# EAGLE design AT26 Chuck (EAGLE 7.2.0)
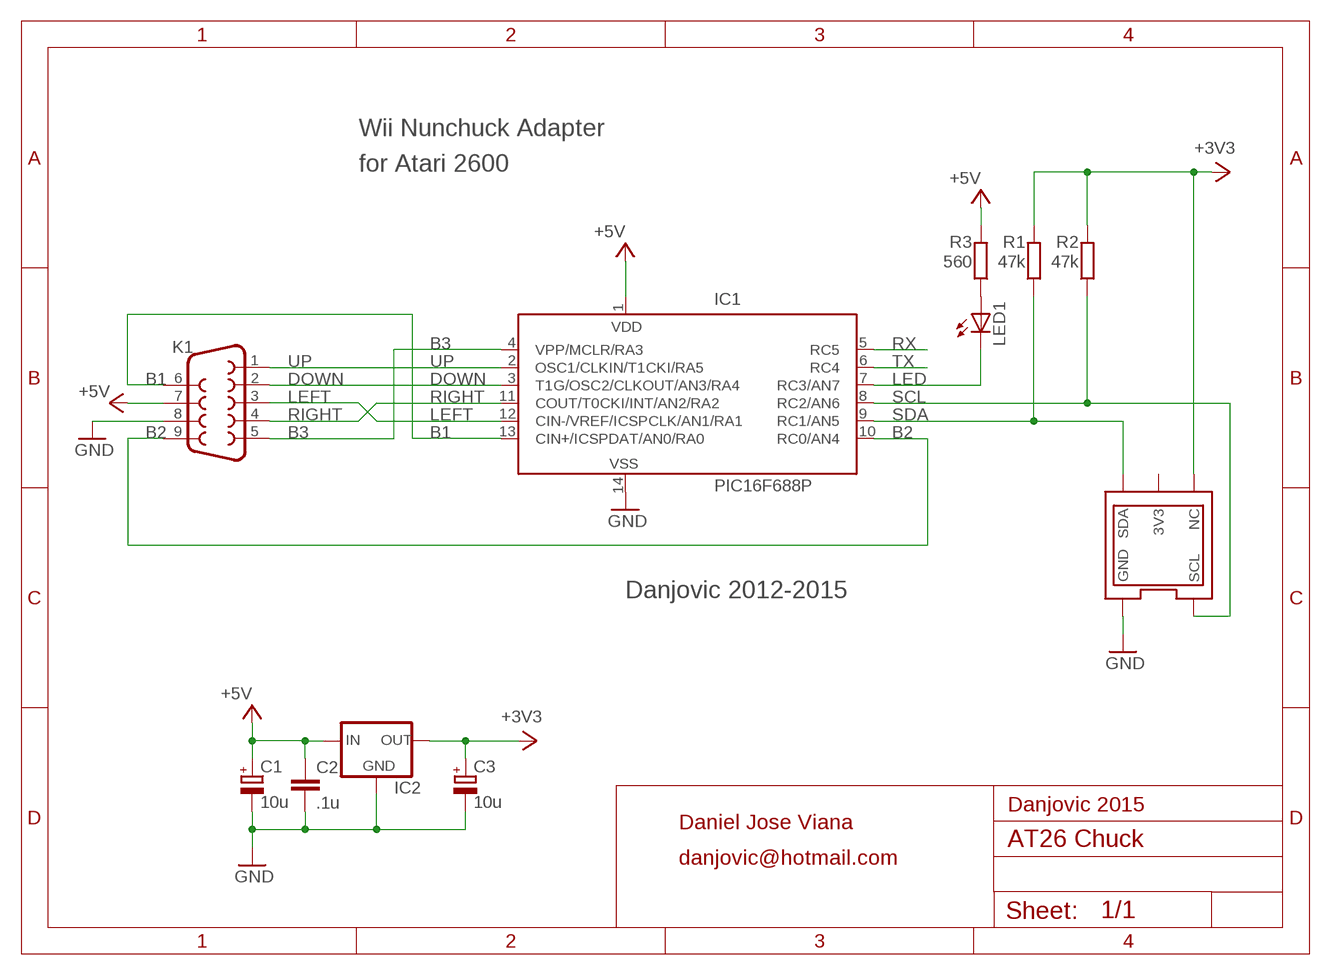
[diagram p0: schematic, sheet 1]

## Parts
C1  10u  CPOL-EUE2.5-5  [E2,5-5]
C2  .1u  C-EU  [C025-024X044L]
C3  10u  CPOL-EUE2.5-5  [E2,5-5]
IC1  PIC16F688P  PIC16F676P  [DIL14]
IC2  78LXX78LXX_L  [78LXX_L]
K1  F09D  [F09D]
LED1  LED3MM  [LED3MM]
R1  47k  R-EU_0204/2V  [0204V]
R2  47k  R-EU_0204/2V  [0204V]
R3  560  R-EU_0204/2V  [0204V]
U$1  NUNCHUCK  NUNCHUCKSLOT  [NUNCHUCK_SLOT]

## Nets
+3V3: C3.+ IC2.OUT R1.2 R2.2 U$1.NC
+5V: C1.+ C2.1 IC1.1(VDD) IC2.IN K1.7 R3.2
B1: IC1.13(CIN+/ICSPDAT/AN0/RA0) K1.6
B2: IC1.10(RC0/AN4) K1.9
B3: IC1.4(VPP/MCLR/RA3) K1.5
DOWN: IC1.3(T1G/OSC2/CLKOUT/AN3/RA4) K1.2
GND: C1.- C2.2 C3.- IC1.14(VSS) IC2.GND K1.8 U$1.GND
LED: IC1.7(RC3/AN7) LED1.K(C)
LEFT: IC1.12(CIN-/VREF/ICSPCLK/AN1/RA1) K1.3
N$4: LED1.A R3.1
RIGHT: IC1.11(COUT/T0CKI/INT/AN2/RA2) K1.4
RX: IC1.5(RC5)
SCL: IC1.8(RC2/AN6) R2.1 U$1.SCL
SDA: IC1.9(RC1/AN5) R1.1 U$1.SDA
TX: IC1.6(RC4)
UP: IC1.2(OSC1/CLKIN/T1CKI/RA5) K1.1
Unconnected: U$1.3V3

## Notes on the sheet
- Wii Nunchuck Adapter
- for Atari 2600
- Danjovic 2012-2015
- Danjovic 2015
- Daniel Jose Viana
- danjovic@hotmail.com

## Library data of the parts
C1 C3 = rcl:CPOL-EU: POLARIZED CAPACITOR, European symbol
C2 = rcl:C-EU: CAPACITOR, European symbol
IC1 = microchip:PIC16F676: 14-Pin, Flash-Based 8-Bit CMOS Microcontroller High Performance RISC CPU: * Only 35 instructions to learn - All single-cycle instructions except branches * Operating speed: - DC - 20 MHz oscillator/clock input - DC - 200 ns instruction cycle * Internal and external oscillator options - Precision Internal 4 MHz oscillator factory calibrated to ±1% - External Oscillator support for crystals and resonators - 5?s wake-up from SLEEP, 3.0V, typical * Power saving SLEEP mode * Wide operating voltage range - 2.0V to 5.5V * Industrial and Extended temperature range * Low power Power-on Reset (POR) * Power-up Timer (PWRT) and Oscillator Start-up Timer (OST) * Brown-out Detect (BOD) * Watchdog Timer (WDT) with independent oscillator for reliable operation * Multiplexed MCLR/Input-pin * Interrupt-on-pin change * Individual programmable weak pull-ups * Programmable code protection * High Endurance FLASH/EEPROM Cell - 100,000 write FLASH endurance - 1,000,000 write EEPROM endurance - FLASH/Data EEPROM Retention: > 40 years * Standby Current: - 1 nA @ 2.0V, typical * Operating Current: - 8.5?A @ 32 kHz, 2.0V, typical - 100?A @ 1 MHz, 2.0V, typical * Watchdog Timer Current - 300 nA @ 2.0V, typical * Timer1 oscillator current: - 4?A @ 32 kHz, 2.0V, typical * 12 I/O pins with individual direction control * High current sink/source for direct LED drive * Analog-to-Digital Converter module (PIC16F676): - 10-bit resolution - Programmable 8-channel input - Voltage reference input * In-Circuit Serial ProgrammingTM (ICSPTM) via two pins Source: http://ww1.microchip.com/downloads/en/DeviceDoc/40039E.pdf; MF: MICROCHIP; MPN: PIC16F676-I/P; OC_FARNELL: 9760512; OC_NEWARK: 54K2829
IC2 = v-reg:78LXX: VOLTAGE REGULATOR
K1 = con-subd:F09: SUB-D; OC_FARNELL: unknown; OC_NEWARK: unknown
LED1 = led:LED: LED OSRAM: - CHIPLED LG R971, LG N971, LY N971, LG Q971, LY Q971, LO R971, LY R971 LH N974, LH R974 LS Q976, LO Q976, LY Q976 LO Q996 - Hyper CHIPLED LW Q18S LB Q993, LB Q99A, LB R99A - SideLED LS A670, LO A670, LY A670, LG A670, LP A670 LB A673, LV A673, LT A673, LW A673 LH A674 LY A675 LS A676, LA A676, LO A676, LY A676, LW A676 LS A679, LY A679, LG A679 - Hyper Micro SIDELED® LS Y876, LA Y876, LO Y876, LY Y876 LT Y87S - SmartLED LW L88C, LW L88S LB L89C, LB L89S, LG L890 LS L89K, LO L89K, LY L89K LS L896, LA L896, LO L896, LY L896 - TOPLED LS T670, LO T670, LY T670, LG T670, LP T670 LSG T670, LSP T670, LSY T670, LOP T670, LYG T670 LG T671, LOG T671, LSG T671 LB T673, LV T673, LT T673, LW T673 LH T674 LS T676, LA T676, LO T676, LY T676, LB T676, LH T676, LSB T676, LW T676 LB T67C, LV T67C, LT T67C, LS T67K, LO T67K, LY T67K, LW E67C LS E67B, LA E67B, LO E67B, LY E67B, LB E67C, LV E67C, LT E67C LW T67C LS T679, LY T679, LG T679 LS T770, LO T770, LY T770, LG T770, LP T770 LB T773, LV T773, LT T773, LW T773 LH T774 LS E675, LA E675, LY E675, LS T675 LS T776, LA T776, LO T776, LY T776, LB T776 LHGB T686 LT T68C, LB T68C - Hyper Mini TOPLED® LB M676 - Mini TOPLED Santana® LG M470 LS M47K, LO M47K, LY M47K Source: http://www.osram.convergy.de LUXEON: - LUMILED® LXK2-PW12-R00, LXK2-PW12-S00, LXK2-PW14-U00, LXK2-PW14-V00 LXK2-PM12-R00, LXK2-PM12-S00, LXK2-PM14-U00 LXK2-PE12-Q00, LXK2-PE12-R00, LXK2-PE12-S00, LXK2-PE14-T00, LXK2-PE14-U00 LXK2-PB12-K00, LXK2-PB12-L00, LXK2-PB12-M00, LXK2-PB14-N00, LXK2-PB14-P00, LXK2-PB14-Q00 LXK2-PR12-L00, LXK2-PR12-M00, LXK2-PR14-Q00, LXK2-PR14-R00 LXK2-PD12-Q00, LXK2-PD12-R00, LXK2-PD12-S00 LXK2-PH12-R00, LXK2-PH12-S00 LXK2-PL12-P00, LXK2-PL12-Q00, LXK2-PL12-R00 Source: www.luxeon.com KINGBRIGHT: KA-3528ASYC Source: www.kingbright.com
R1-R3 = rcl:R-EU_: RESISTOR, European symbol
U$1 = diversos2:NUNCHUCK

## Board
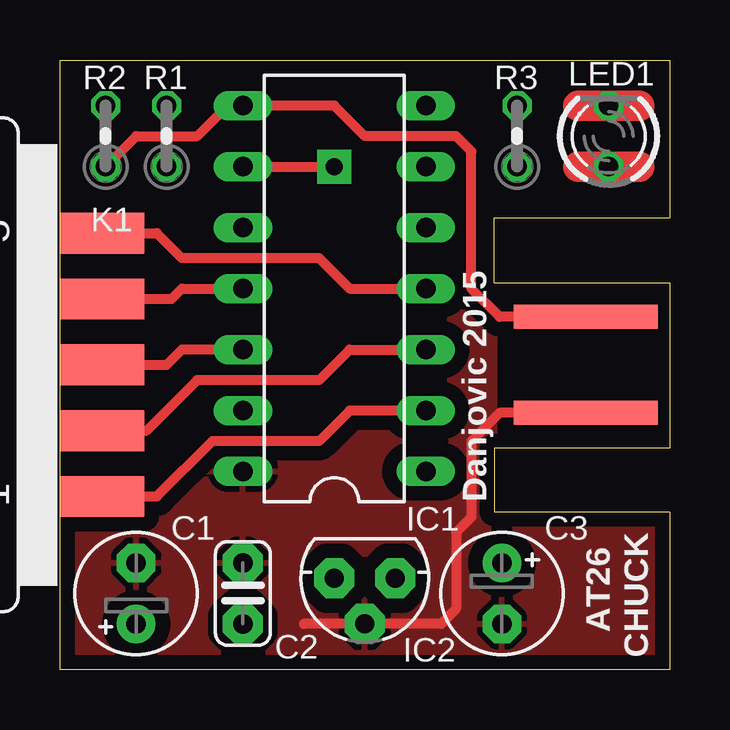
[diagram p1: board, top side]
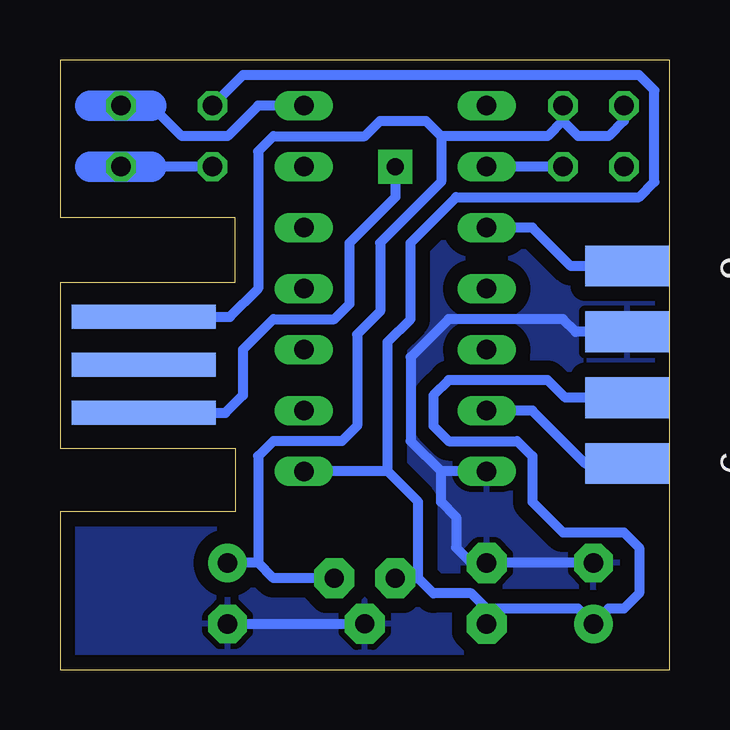
[diagram p2: board, bottom side, seen from below]

Size 25.4 x 25.4 mm. Coordinates in mm from the lower left corner, seen from the top.
Outline: 25.4,18.83 25.4,25.4 0,25.4 0,0 25.4,0 25.4,6.57
Copper layers (1*16): Top 0.0356mm / dielectric 1.5011mm / Bottom 0.0356mm
Design rules "LaenPCBOrder *": minimum track width 6mil, minimum drill 13mil, track to track 6mil, track to pad 6mil, pad to pad 6mil, via to via 6mil, smd to smd 6mil, copper to edge 15mil, drill to drill 6mil, minimum pad ring 7mil, minimum via ring 7mil, stop-mask expansion 3mil, vias tented up to drill 0mil, thermal gap 10mil

### Footprints (pad centres in the part's own frame; a part is rotated, then mirrored left to right if it is on the bottom)
E2,5-5 = drill 0.813 pad 1.6: + -1.27,0 | drill 0.813 pad 1.6 octagon: - 1.27,0
C025-024X044L = drill 0.813 pad 1.676 octagon: 1 -1.27,0; 2 1.27,0
DIL14 = drill 0.813 long: 1 -7.62,-3.81; 2 -5.08,-3.81; 3 -2.54,-3.81; 4 0,-3.81; 5 2.54,-3.81; 6 5.08,-3.81; 7 7.62,-3.81; 8 7.62,3.81; 9 5.08,3.81; 10 2.54,3.81; 11 0,3.81; 12 -2.54,3.81; 13 -5.08,3.81; 14 -7.62,3.81
78LXX_L = drill 0.8 pad 1.676 octagon: GND 0,1.905; IN 1.27,0; OUT -1.27,0
F09D = smd 1.7 x 3.5: 1 -5.486,-6.045; 2 -2.743,-6.045; 3 0,-6.045; 4 2.743,-6.045; 5 5.486,-6.045 | smd 1.7 x 3.5 bottom: 6 -4.115,-6.045; 7 -1.372,-6.045; 8 1.372,-6.045; 9 4.115,-6.045
LED3MM = drill 0.813 octagon: A -1.27,0; K 1.27,0
0204V = drill 0.813 octagon: 1 -1.27,0; 2 1.27,0
NUNCHUCK_SLOT = smd 6 x 1: 3V3 0,0; NC 0,-2; SDA 0,2 | smd 6 x 1 bottom: GND 0,2; SCL 0,-2

### Placement (x,y rotation side)
C1  3.17,3.17 90 top
C2  7.62,3.17 90 top
C3  18.41,3.17 270 top
IC1  11.43,15.88 90 top
IC2  12.7,3.81 180 top
K1  -4.28,12.7 90 top
LED1  22.86,22.23 90 top
R1  4.45,22.23 90 top
R2  1.91,22.23 90 top
R3  19.05,22.23 90 top
U$1  21.91,12.7 180 bottom

### Tracks (layer width: path | path; a pad name or v marks a point on that pad's centre or on a via)
+3V3
  Bottom 0.406: IC2.OUT 16.51,3.81 17.14,4.45 | 17.14,4.45 C3.+ | 17.14,4.45 17.14,8.89 16.51,9.53 13.65,9.53 13.02,10.16 13.02,13.97 12.06,14.92 12.06,17.78 9.53,20.32 9.53,22.23 | U$1.NC 18.32,14.7 17.14,15.88 17.14,21.59 16.51,22.23 12.7,22.23 12.06,22.86 10.16,22.86 9.53,22.23 | R2.2 1.91,22.86 2.54,22.23 3.81,22.23 4.45,22.86 | 4.45,22.86 5.08,22.23 9.53,22.23 | R1.2 4.45,22.86
+5V
  Bottom 0.406: K1.7 4.34,11.33 5.08,12.06 9.21,12.06 9.84,11.43 9.84,10.16 9.21,9.53 6.35,9.53 5.71,8.89 5.71,6.99 4.45,5.71 1.91,5.71 1.27,5.08 1.27,3.17 1.91,2.54 2.54,2.54 C1.+ 3.81,2.54 7.62,2.54 | C2.1 7.62,2.54 | 7.62,2.54 8.26,3.17 9.84,3.17 10.48,3.81 | IC2.IN 10.48,3.81 | 10.48,3.81 10.48,6.99 11.75,8.26 | 11.75,8.26 IC1.1 | 11.75,8.26 11.75,13.65 10.79,14.61 10.79,17.78 8.89,19.68 1.27,19.68 0.64,20.32 0.64,24.13 1.27,24.77 17.78,24.77 R3.2
B1
  Bottom 0.406: K1.6 3.5,8.59 5.71,10.79 IC1.13
B2
  Bottom 0.406: K1.9 4.12,16.82 5.71,18.41 IC1.10
B3
  Top 0.406: IC1.4 12.06,15.88 10.79,17.14 5.08,17.14 4.04,18.19 K1.5
DOWN
  Top 0.406: K1.2 3.61,9.96 5.71,12.06 10.79,12.06 12.06,13.34 IC1.3
GND
  Top 0.406: 10.16,1.91 IC2.GND 15.88,1.91 16.51,2.54 16.51,5.71 17.14,6.35 17.14,9.53 18.32,10.7 U$1.GND
  Bottom 0.406: K1.8 3.91,14.07 4.45,14.61 9.21,14.61 10.79,13.02 10.79,9.53 9.53,8.26 | C1.- 8.26,4.45 8.89,5.08 8.89,6.35 9.53,6.99 9.53,8.26 | C3.- IC2.GND | IC1.14 9.53,8.26
  pour Top (isolate 0.61): 0,25.4 25.4,25.4 25.4,18.73 18.1,18.73 18.1,6.67 25.4,6.67 25.4,0 0,0
  pour Bottom (isolate 0.61): 0,25.4 25.4,25.4 25.4,18.73 18.1,18.73 18.1,6.67 25.4,6.67 25.4,0 0,0
LED
  Top 1.27: 21.59,23.5 LED1.K 24.13,23.5
  Bottom 0.406: IC1.7 17.14,23.5 18.41,22.23 20.32,22.23 21.59,23.5
  Bottom 1.27: 21.59,23.5 LED1.K 24.13,23.5
LEFT
  Top 0.406: IC1.12 5.08,13.34 4.45,12.7 K1.3
N$4
  Top 1.27: 24.13,20.95 LED1.A 21.59,20.95
  Bottom 0.406: R3.1 21.59,20.95
  Bottom 1.27: 21.59,20.95 LED1.A 24.13,20.95
RIGHT
  Top 0.406: K1.4 4.65,15.44 5.08,15.88 IC1.11
SCL
  Top 0.406: U$1.SCL 18.32,14.7 17.14,15.88 17.14,21.59 16.51,22.23 12.7,22.23 11.43,23.5 IC1.8 6.99,23.5 5.71,22.23 3.17,22.23 R2.1
SDA  (via drill 0.7 pad 1.42)
  Top 0.406: IC1.9 v11.43,20.95
  Bottom 0.406: U$1.SDA 18.51,10.7 17.78,11.43 17.78,13.34 16.51,14.61 13.97,14.61 13.34,15.24 13.34,17.78 11.43,19.68 v11.43,20.95 | R1.1 IC1.9
UP
  Top 0.406: K1.1 4.04,7.21 6.35,9.53 10.79,9.53 12.06,10.79 IC1.2

### Text on the board
tNames: Danjovic 2015 | CHUCK | AT26